# EAGLE design leka (EAGLE 7.2.0)
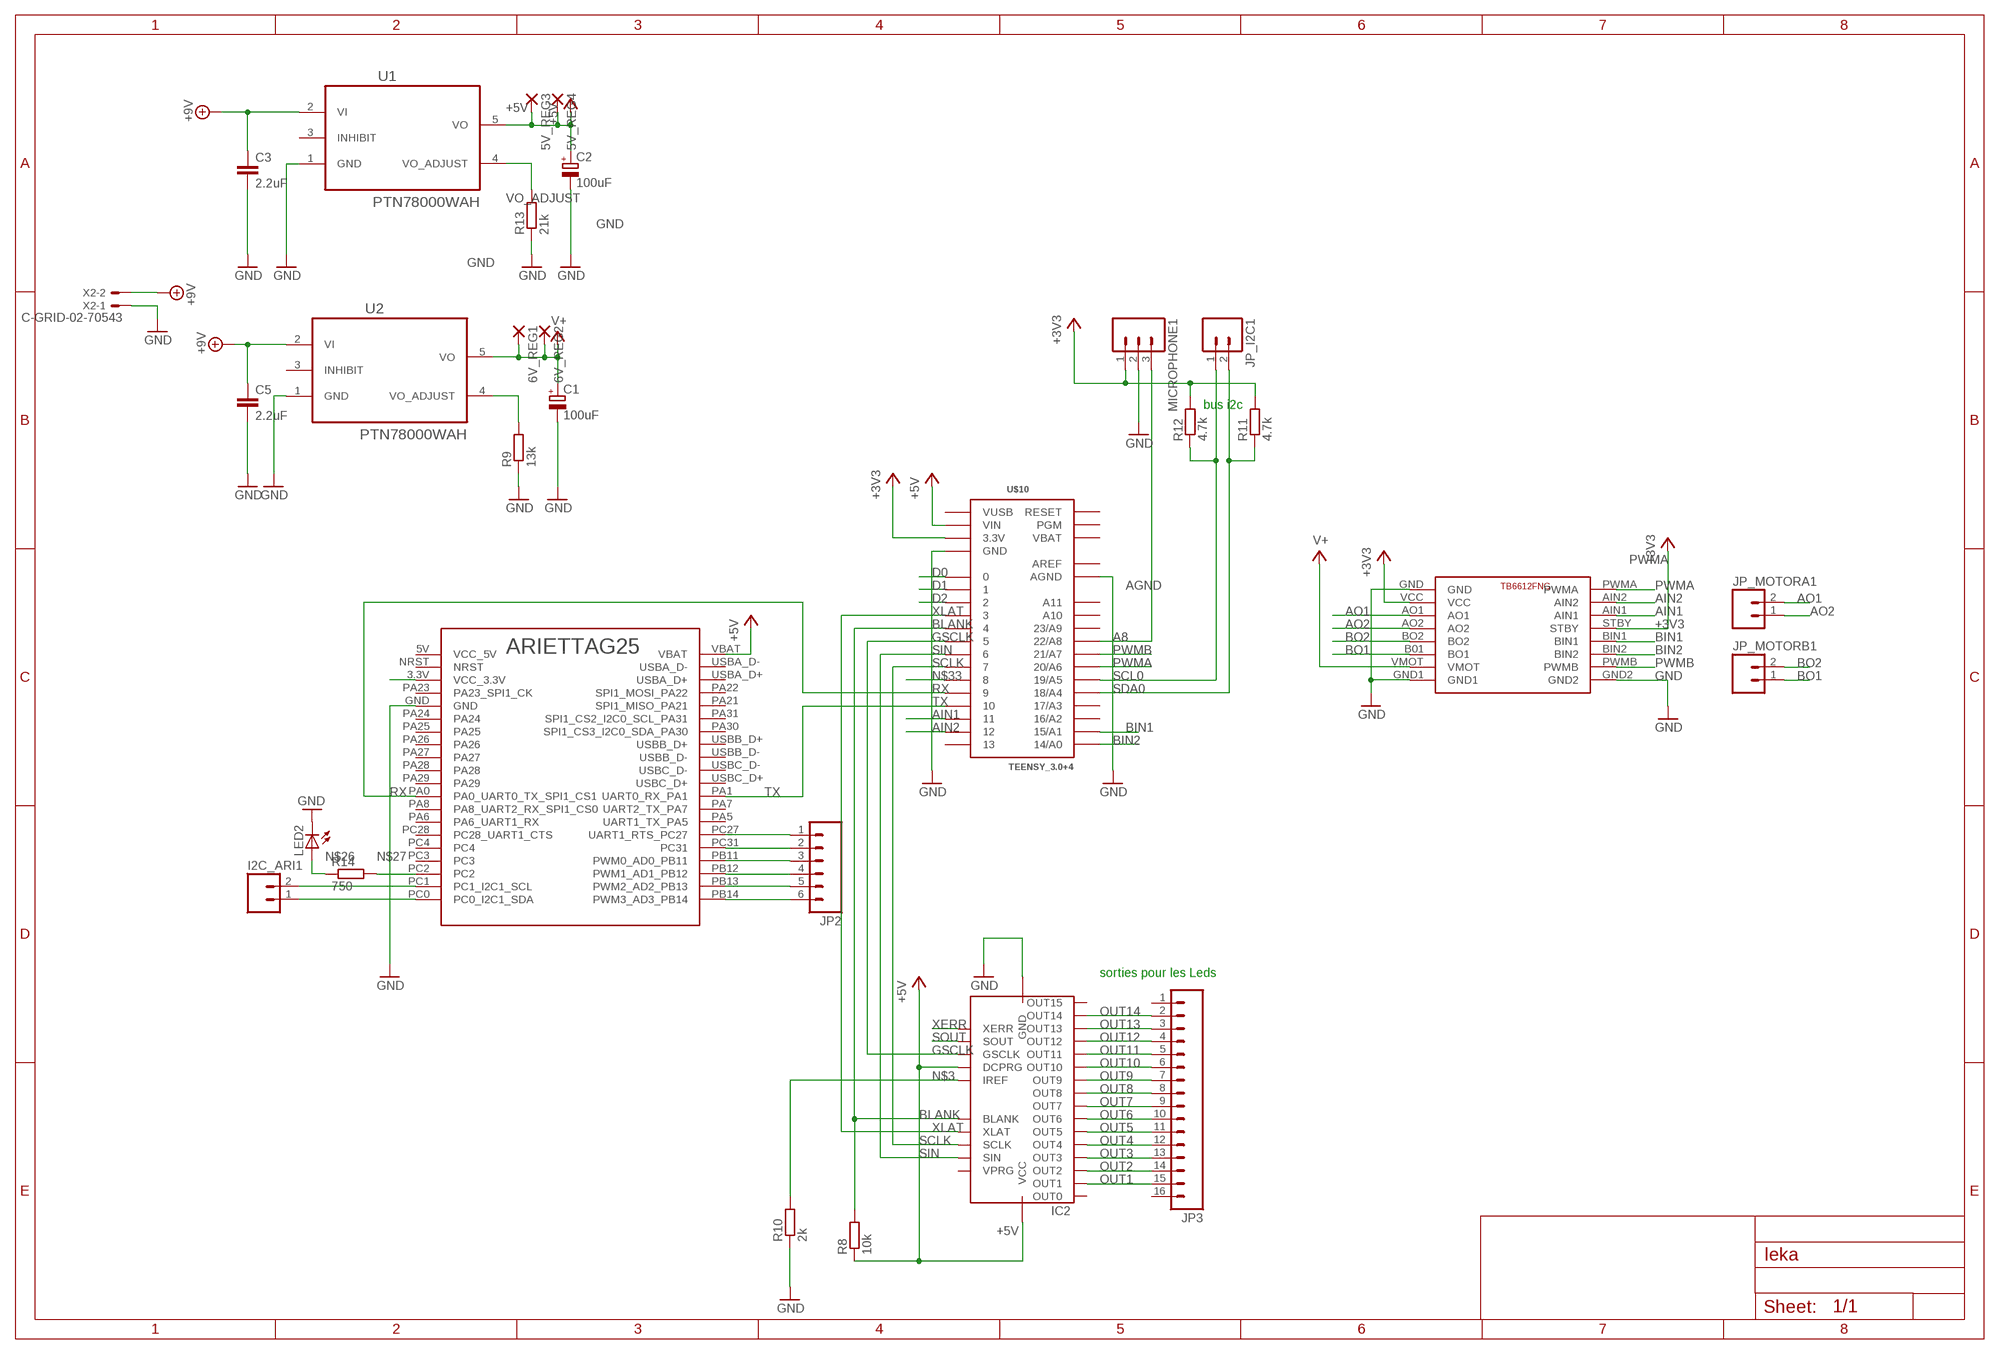
[diagram p0: schematic, sheet 1]

## Parts
5V_REG3  2,54/0,9  [2,54/0,9]
5V_REG4  2,54/0,9  [2,54/0,9]
6V_REG1  2,54/0,9  [2,54/0,9]
6V_REG2  2,54/0,9  [2,54/0,9]
C1  100uF  CPOL-EUE2-5  [E2-5]
C2  100uF  CPOL-EUE2-5  [E2-5]
C3  2.2uF  C-EUC0805  [C0805]
C5  2.2uF  C-EUC0805  [C0805]
I2C_ARI1  M02LOCK_LONGPADS  [1X02_LOCK_LONGPADS]
IC2  IC-PACKAGE_DIL28-3  [IC-PACKAGE_DIL28-3]
JP2  M06SILK_FEMALE_PTH  [1X06]
JP3  M16LONGPADS  [1X16_LONGPADS]
JP_I2C1  M02LOCK_LONGPADS  [1X02_LOCK_LONGPADS]
JP_MOTORA1  M02JST-PTH-2  [JST-2-PTH]
JP_MOTORB1  M02JST-PTH-2  [JST-2-PTH]
LED2  LEDSML0805  [SML0805]
MICROPHONE1  M03PTH  [1X03]
R8  10k  R-EU_M0805  [M0805]
R9  13k  R-EU_M0805  [M0805]
R10  2k  R-EU_M0805  [M0805]
R11  4.7k  R-EU_M0805  [M0805]
R12  4.7k  R-EU_M0805  [M0805]
R13  21k  R-EU_M0805  [M0805]
R14  750  R-EU_M0805  [M0805]
U1  PTN78000WAH  [TI_PTN78000WAH]
U2  PTN78000WAH  [TI_PTN78000WAH]
U$2  ARIETTAG25/256  [ARIETTAG25]
U$6  TB6612FNG  [MOTOR_DRIVER]
U$10  TEENSY_3.0+4  [TEENSY_3.0+4]
X2  C-GRID-02-70543  [70543-02]

## Nets
+3V3: MICROPHONE1.1 R11.2 R12.2 U$6.STBY U$6.VCC U$10.3.3V U$10.3.3V1(3.3V)
+5V: 5V_REG3.1(P) 5V_REG4.1(P) C2.+ IC2.19(DCPRG) IC2.21(VCC) R8.1 U1.5(VO) U$2.VBAT U$10.VIN
+9V: C3.1 C5.1 U1.2(VI) U2.2(VI) X2.2
A8: MICROPHONE1.3 U$10.22/A8
AGND: U$10.AGND ; supply symbol labelled GND
AIN1: U$6.AIN1 U$10.11
AIN2: U$6.AIN2 U$10.12
AO1: JP_MOTORA1.2 U$6.AO1
AO2: JP_MOTORA1.1 U$6.AO2
BIN1: U$6.BIN1 U$10.15/A1
BIN2: U$6.BIN2 U$10.14/A0
BLANK: IC2.23(BLANK) R8.2 U$10.4
BO1: JP_MOTORB1.1 U$6.B01(BO1)
BO2: JP_MOTORB1.2 U$6.BO2
D0: U$10.0
D1: U$10.1
D2: U$10.2
GND: C1.- C2.- C3.2 C5.2 IC2.22(GND) LED2.C MICROPHONE1.2 R9.1 R10.1 R13.1 U1.1(GND) U2.1(GND) U$2.GND U$6.GND U$6.GND1 U$6.GND2 U$10.GND U$10.GND1(GND) X2.1
GSCLK: IC2.18(GSCLK) U$10.5
N$3: IC2.20(IREF) R10.2
N$15: U$2.3.3V(VCC_3.3V)
N$16: I2C_ARI1.1 U$2.PC0(PC0_I2C1_SDA)
N$17: I2C_ARI1.2 U$2.PC1(PC1_I2C1_SCL)
N$19: R9.2 U2.4(VO_ADJUST)
N$20: JP2.6 U$2.PB14(PWM3_AD3_PB14)
N$21: JP2.5 U$2.PB13(PWM2_AD2_PB13)
N$22: JP2.4 U$2.PB12(PWM1_AD1_PB12)
N$23: JP2.2 U$2.PC31
N$24: JP2.1 U$2.PC27(UART1_RTS_PC27)
N$25: JP2.3 U$2.PB11(PWM0_AD0_PB11)
N$26: LED2.A R14.1
N$27: R14.2 U$2.PC2
N$33: U$10.8
OUT1: IC2.1(OUT1) JP3.15
OUT2: IC2.2(OUT2) JP3.14
OUT3: IC2.3(OUT3) JP3.13
OUT4: IC2.4(OUT4) JP3.12
OUT5: IC2.5(OUT5) JP3.11
OUT6: IC2.6(OUT6) JP3.10
OUT7: IC2.7(OUT7) JP3.9
OUT8: IC2.8(OUT8) JP3.8
OUT9: IC2.9(OUT9) JP3.7
OUT10: IC2.10(OUT10) JP3.6
OUT11: IC2.11(OUT11) JP3.5
OUT12: IC2.12(OUT12) JP3.4
OUT13: IC2.13(OUT13) JP3.3
OUT14: IC2.14(OUT14) JP3.2
PWMA: U$6.PWMA U$10.20/A6
PWMB: U$6.PWMB U$10.21/A7
RX: U$2.PA0(PA0_UART0_TX_SPI1_CS1) U$10.9
SCL0: JP_I2C1.1 R12.1 U$10.19/A5
SCLK: IC2.25(SCLK) U$10.7
SDA0: JP_I2C1.2 R11.1 U$10.18/A4
SIN: IC2.26(SIN) U$10.6
SOUT: IC2.17(SOUT)
TX: U$2.PA1(UART0_RX_PA1) U$10.10
V+: 6V_REG1.1(P) 6V_REG2.1(P) C1.+ U2.5(VO) U$6.VMOT
VO_ADJUST: R13.2 U1.4(VO_ADJUST)
XERR: IC2.16(XERR)
XLAT: IC2.24(XLAT) U$10.3
Unconnected: IC2.15(OUT15) IC2.27(VPRG) IC2.28(OUT0) JP3.1 JP3.16 U1.3(INHIBIT) U2.3(INHIBIT) U$2.NRST U$2.PA5(UART1_TX_PA5) U$2.PA6(PA6_UART1_RX) U$2.PA7(UART2_TX_PA7) U$2.PA8(PA8_UART2_RX_SPI1_CS0) U$2.PA21(SPI1_MISO_PA21) U$2.PA22(SPI1_MOSI_PA22) U$2.PA23(PA23_SPI1_CK) U$2.PA24 U$2.PA25 U$2.PA26 U$2.PA27 U$2.PA28 U$2.PA29 U$2.PA30(SPI1_CS3_I2C0_SDA_PA30) U$2.PA31(SPI1_CS2_I2C0_SCL_PA31) U$2.PC3 U$2.PC4 U$2.PC28(PC28_UART1_CTS) U$2.USBA_D+ U$2.USBA_D- U$2.USBB_D+ U$2.USBB_D- U$2.USBC_D+ U$2.USBC_D- U$10.13 U$10.16/A2 U$10.17/A3 U$10.23/A9 U$10.A10 U$10.A11 U$10.PGM U$10.RESET

## Notes on the sheet
- bus i2c
- sorties pour les Leds

## Power pins joined to a net without a drawn wire
AREF: U$10.AREF
VBAT: U$10.VBAT
VCC_5V: U$2.5V(VCC_5V)
VUSB: U$10.VUSB

## Library data of the parts
5V_REG3 5V_REG4 6V_REG1 6V_REG2 = wirepad:2,54/0,9: THROUGH-HOLE PAD
C1 C2 = resistor:CPOL-EU: POLARIZED CAPACITOR, European symbol
C3 C5 = resistor:C-EU: CAPACITOR, European symbol
I2C_ARI1 JP_I2C1 = SparkFun-Connectors:M02: Standard 2-pin 0.1" header. Use with - straight break away headers ( PRT-00116) - right angle break away headers (PRT-00553) - swiss pins (PRT-00743) - machine pins (PRT-00117) - female headers (PRT-00115) Molex polarized connector foot print use with: PRT-08233 with associated crimp pins and housings. 2.54_SCREWTERM for use with PRT-10571. 3.5mm Screw Terminal footprints for PRT-08084 5mm Screw Terminal footprints for use with PRT-08432
IC2 = TLC5940:IC-PACKAGE_DIL28: Dual In Line
JP2 = SparkFun-Connectors:M06: Header 6 Standard 6-pin 0.1" header. Use with straight break away headers (SKU : PRT-00116), right angle break away headers (PRT-00553), swiss pins (PRT-00743), machine pins (PRT-00117), and female headers (PRT-00115). Molex polarized connector foot print use with SKU : PRT-08094 with associated crimp pins and housings. NOTES ON THE VARIANTS LOCK and LOCK_LONGPADS... This footprint was designed to help hold the alignment of a through-hole component (i.e. 6-pin header) while soldering it into place. You may notice that each hole has been shifted either up or down by 0.005 of an inch from it's more standard position (which is a perfectly straight line). This slight alteration caused the pins (the squares in the middle) to touch the edges of the holes. Because they are alternating, it causes a "brace" to hold the component in place. 0.005 has proven to be the perfect amount of "off-center" position when using our standard breakaway headers. Although looks a little odd when you look at the bare footprint, once you have a header in there, the alteration is very hard to notice. Also,if you push a header all the way into place, it is covered up entirely on the bottom side. This idea of altering the position of holes to aid alignment will be further integrated into the Sparkfun Library for other footprints. It can help hold any component with 3 or more connection pins.; PROD_ID: CONN-08437
JP3 = SparkFun-Connectors:M16: 1x16 .1" header
JP_MOTORA1 JP_MOTORB1 = SparkFun-Connectors:M02: Standard 2-pin 0.1" header. Use with - straight break away headers ( PRT-00116) - right angle break away headers (PRT-00553) - swiss pins (PRT-00743) - machine pins (PRT-00117) - female headers (PRT-00115) Molex polarized connector foot print use with: PRT-08233 with associated crimp pins and housings. 2.54_SCREWTERM for use with PRT-10571. 3.5mm Screw Terminal footprints for PRT-08084 5mm Screw Terminal footprints for use with PRT-08432; PROD_ID: CONN-09863; SKU: PRT-09914
LED2 = led:LED: LED OSRAM: - CHIPLED LG R971, LG N971, LY N971, LG Q971, LY Q971, LO R971, LY R971 LH N974, LH R974 LS Q976, LO Q976, LY Q976 LO Q996 - Hyper CHIPLED LW Q18S LB Q993, LB Q99A, LB R99A - SideLED LS A670, LO A670, LY A670, LG A670, LP A670 LB A673, LV A673, LT A673, LW A673 LH A674 LY A675 LS A676, LA A676, LO A676, LY A676, LW A676 LS A679, LY A679, LG A679 - Hyper Micro SIDELED® LS Y876, LA Y876, LO Y876, LY Y876 LT Y87S - SmartLED LW L88C, LW L88S LB L89C, LB L89S, LG L890 LS L89K, LO L89K, LY L89K LS L896, LA L896, LO L896, LY L896 - TOPLED LS T670, LO T670, LY T670, LG T670, LP T670 LSG T670, LSP T670, LSY T670, LOP T670, LYG T670 LG T671, LOG T671, LSG T671 LB T673, LV T673, LT T673, LW T673 LH T674 LS T676, LA T676, LO T676, LY T676, LB T676, LH T676, LSB T676, LW T676 LB T67C, LV T67C, LT T67C, LS T67K, LO T67K, LY T67K, LW E67C LS E67B, LA E67B, LO E67B, LY E67B, LB E67C, LV E67C, LT E67C LW T67C LS T679, LY T679, LG T679 LS T770, LO T770, LY T770, LG T770, LP T770 LB T773, LV T773, LT T773, LW T773 LH T774 LS E675, LA E675, LY E675, LS T675 LS T776, LA T776, LO T776, LY T776, LB T776 LHGB T686 LT T68C, LB T68C - Hyper Mini TOPLED® LB M676 - Mini TOPLED Santana® LG M470 LS M47K, LO M47K, LY M47K Source: http://www.osram.convergy.de LUXEON: - LUMILED® LXK2-PW12-R00, LXK2-PW12-S00, LXK2-PW14-U00, LXK2-PW14-V00 LXK2-PM12-R00, LXK2-PM12-S00, LXK2-PM14-U00 LXK2-PE12-Q00, LXK2-PE12-R00, LXK2-PE12-S00, LXK2-PE14-T00, LXK2-PE14-U00 LXK2-PB12-K00, LXK2-PB12-L00, LXK2-PB12-M00, LXK2-PB14-N00, LXK2-PB14-P00, LXK2-PB14-Q00 LXK2-PR12-L00, LXK2-PR12-M00, LXK2-PR14-Q00, LXK2-PR14-R00 LXK2-PD12-Q00, LXK2-PD12-R00, LXK2-PD12-S00 LXK2-PH12-R00, LXK2-PH12-S00 LXK2-PL12-P00, LXK2-PL12-Q00, LXK2-PL12-R00 Source: www.luxeon.com KINGBRIGHT: KA-3528ASYC Source: www.kingbright.com
MICROPHONE1 = SparkFun-Connectors:M03: Header 3 Standard 3-pin 0.1" header. Use with straight break away headers (SKU : PRT-00116), right angle break away headers (PRT-00553), swiss pins (PRT-00743), machine pins (PRT-00117), and female headers (PRT-00115). Molex polarized connector foot print use with SKU : PRT-08232 with associated crimp pins and housings.
R8-R14 = resistor:R-EU_: RESISTOR, European symbol
U1 U2 = TI-Eagle_library:PTN78000WAH: SWITCHING REG, 2.5 TO 12.6V 1.5A,Through-Hole Module; MPN: PTN78000WAH; OC_FARNELL: 1564908; OC_NEWARK: 65J6317; PACKAGE: Through-Hole Module; SUPPLIER: TEXAS INSTRUMENTS
U$2 = robot_insa_V1:ARIETTAG25/256
U$6 = motor_driver:TB6612FNG
U$10 = Teensy3.0:TEENSY_3.0+4: Teensy 3.0 board, showing all pins that are easily acessible. See 'AllAnalogPins" and 'AllPins' packages for additional pin holes, as needed. The 'Basic' package has fewer pins.
X2 = con-molex:C-GRID-02: CONNECTOR wire to board 2.54 mm (0.100") pitch header; OC_FARNELL: unknown; OC_NEWARK: unknown

## Board
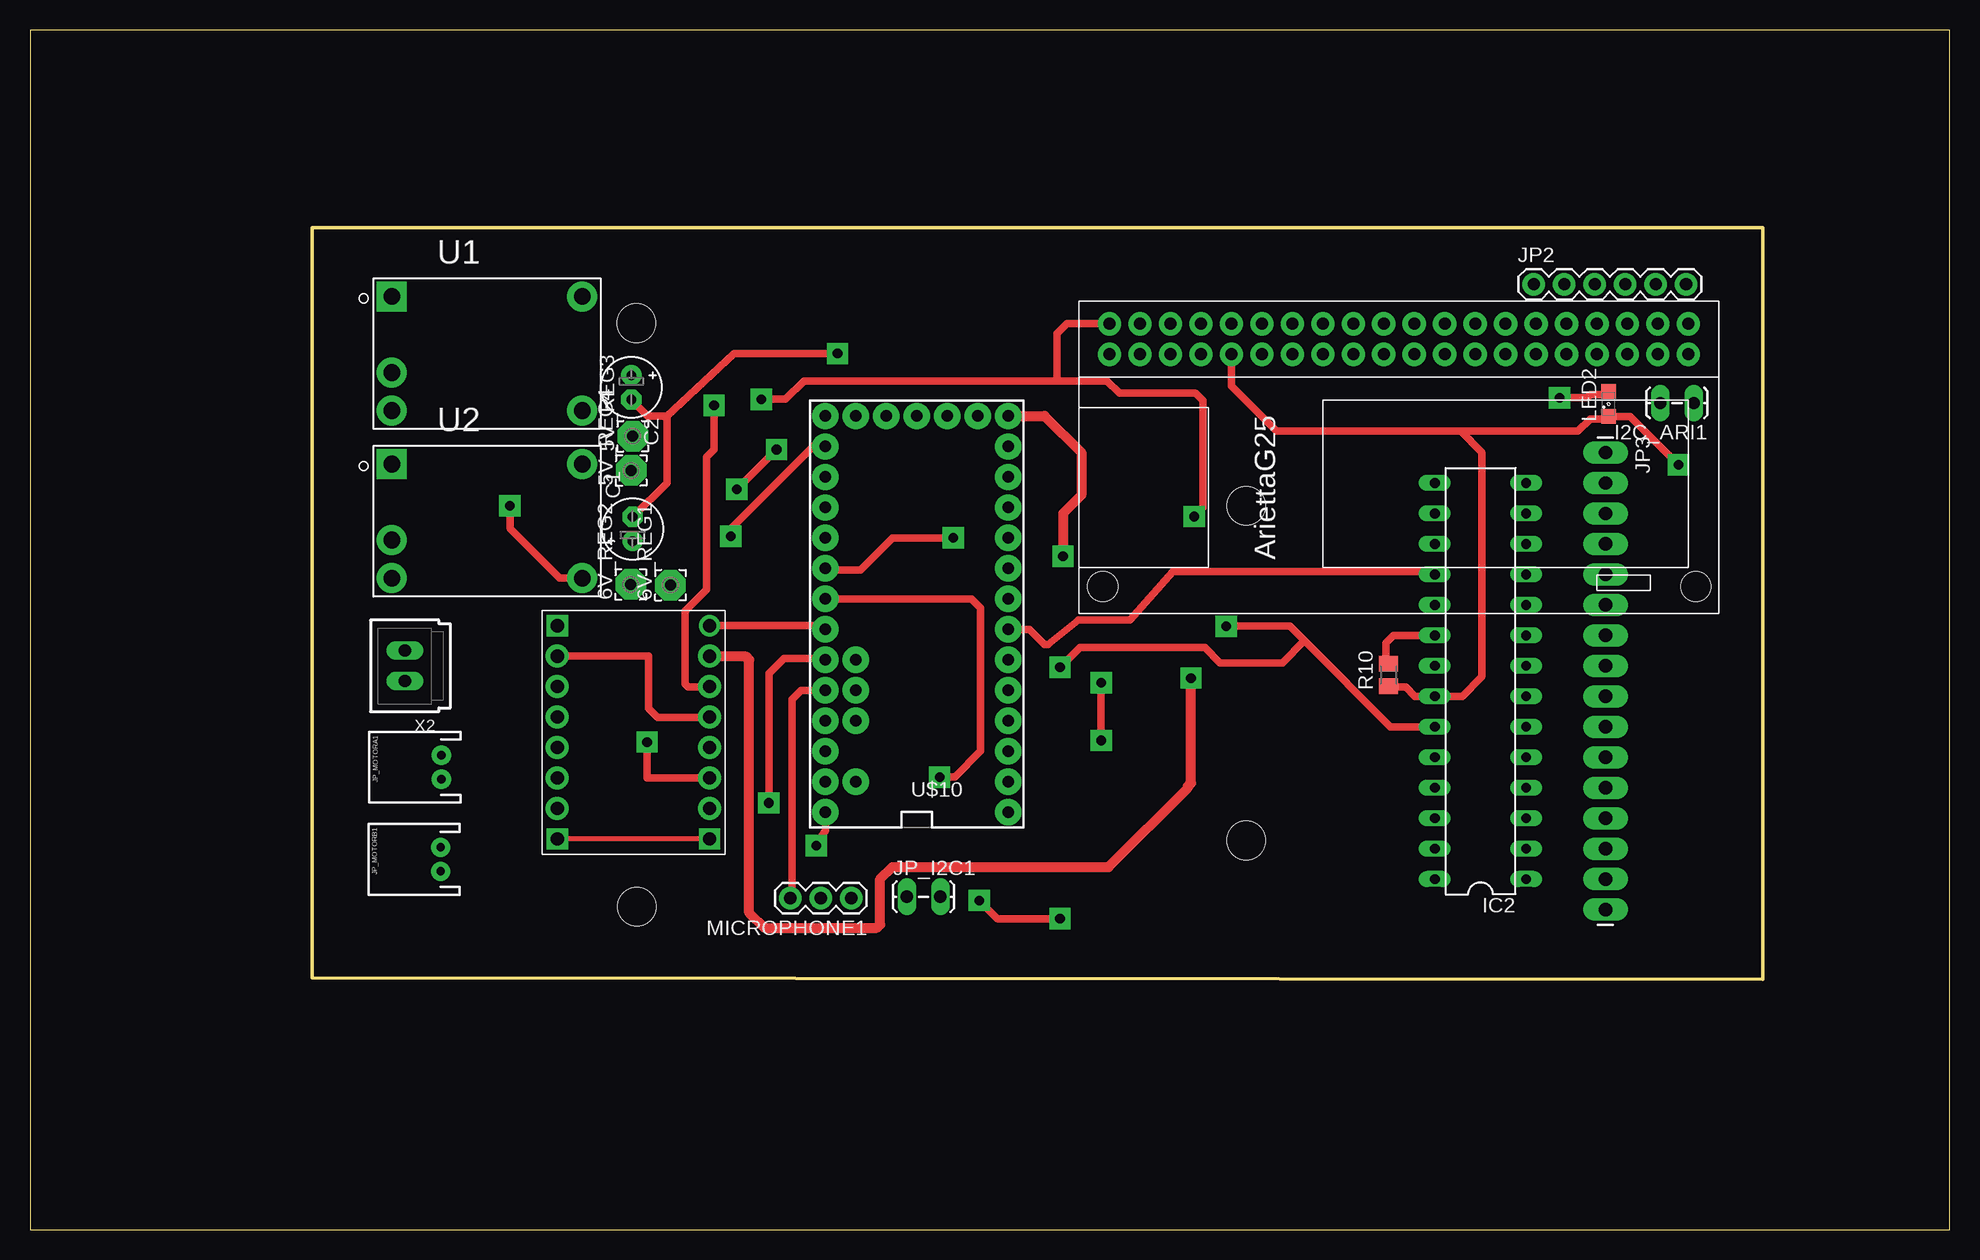
[diagram p1: board, top side]
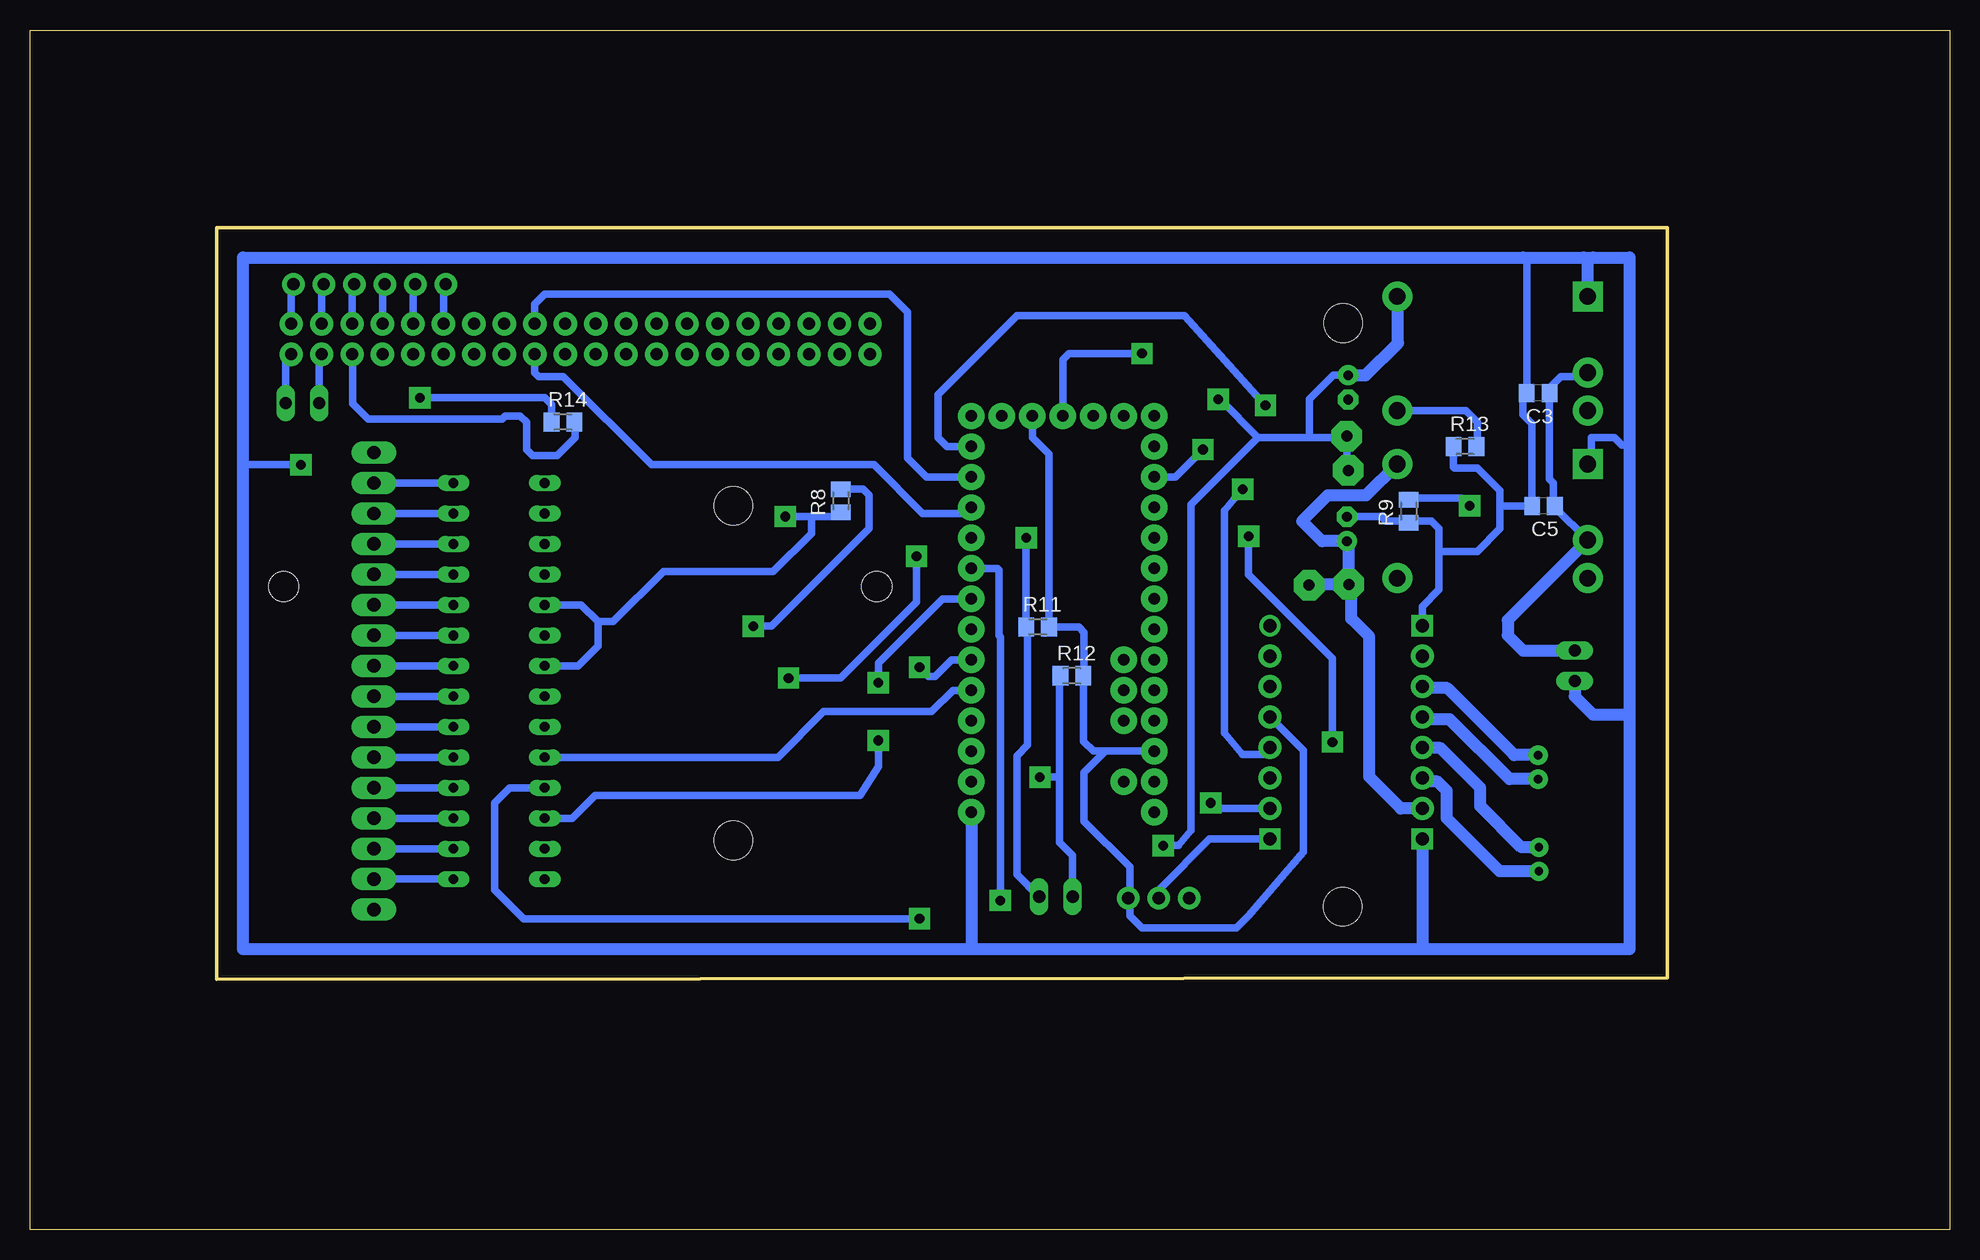
[diagram p2: board, bottom side, seen from below]

Size 160 x 100 mm. Coordinates in mm from the lower left corner, seen from the top.
Outline: 0,0 160,0 160,100 0,100 0,0
Outline: 23.52,83.52 23.52,21 144.42,20.87 144.42,83.52 23.52,83.52
Copper layers (1*16): Top 0.035mm / dielectric 1.5mm / Bottom 0.035mm
Design rules "default *": minimum track width 10mil, minimum drill 24mil, track to track 8mil, track to pad 8mil, pad to pad 8mil, via to via 8mil, smd to smd 8mil, copper to edge 40mil, drill to drill 12mil, minimum pad ring 10mil, minimum via ring 8mil, stop-mask expansion 4mil, vias tented up to drill 0mil, thermal gap 10mil
Holes 3.2 mm at 50.57,26.92 50.55,75.56 101.37,60.33 101.37,32.44

### Footprints (pad centres in the part's own frame; a part is rotated, then mirrored left to right if it is on the bottom)
2,54/0,9 = drill 0.914 pad 2.54 octagon: 1 0,0
E2-5 = drill 0.813 pad 1.676: + -1.016,0 | drill 0.813 pad 1.676 octagon: - 1.016,0
C0805 = smd 1.3 x 1.5: 1 -0.95,0; 2 0.95,0
1X02_LOCK_LONGPADS = drill 1.016 long: 1 -0.127,0; 2 2.667,0
IC-PACKAGE_DIL28-3 = drill 0.813 long: 1 -16.51,-3.81; 2 -13.97,-3.81; 3 -11.43,-3.81; 4 -8.89,-3.81; 5 -6.35,-3.81; 6 -3.81,-3.81; 7 -1.27,-3.81; 8 1.27,-3.81; 9 3.81,-3.81; 10 6.35,-3.81; 11 8.89,-3.81; 12 11.43,-3.81; 13 13.97,-3.81; 14 16.51,-3.81; 15 16.51,3.81; 16 13.97,3.81; 17 11.43,3.81; 18 8.89,3.81; 19 6.35,3.81; 20 3.81,3.81; 21 1.27,3.81; 22 -1.27,3.81; 23 -3.81,3.81; 24 -6.35,3.81; 25 -8.89,3.81; 26 -11.43,3.81; 27 -13.97,3.81; 28 -16.51,3.81
1X06 = drill 1.016 pad 1.88: 1 0,0; 2 2.54,0; 3 5.08,0; 4 7.62,0; 5 10.16,0; 6 12.7,0
1X16_LONGPADS = drill 1.118 pad 1.88 long: 1 0,0; 2 2.54,0; 3 5.08,0; 4 7.62,0; 5 10.16,0; 6 12.7,0; 7 15.24,0; 8 17.78,0; 9 20.32,0; 10 22.86,0; 11 25.4,0; 12 27.94,0; 13 30.48,0; 14 33.02,0; 15 35.56,0; 16 38.1,0
JST-2-PTH = drill 0.7 pad 1.6: 1 -1,0; 2 1,0
SML0805 = smd 1.2 x 1.2: A 1.05,0; C -1.05,0
1X03 = drill 1.016 pad 1.88: 1 0,0; 2 2.54,0; 3 5.08,0
M0805 = smd 1.3 x 1.6: 1 -0.95,0; 2 0.95,0
TI_PTN78000WAH = drill 1.4 pad 2.5 square: 1 -7.94,4.763 | drill 1.4 pad 2.5: 2 -7.94,-1.587; 3 -7.94,-4.763; 4 7.94,-4.763; 5 7.94,4.763
ARIETTAG25 = drill 1 pad 1.93: 3.3V 10.16,20.32; 5V 10.16,25.4; GND 10.16,15.24; NRST 10.16,22.86; PA0 10.16,-2.54; PA1 12.7,-2.54; PA5 12.7,-7.62; PA6 10.16,-7.62; PA7 12.7,-5.08; PA8 10.16,-5.08; PA21 12.7,15.24; PA22 12.7,17.78; PA23 10.16,17.78; PA24 10.16,12.7; PA25 10.16,10.16; PA26 10.16,7.62; PA27 10.16,5.08; PA28 10.16,2.54; PA29 10.16,0; PA30 12.7,10.16; PA31 12.7,12.7; PB11 12.7,-15.24; PB12 12.7,-17.78; PB13 12.7,-20.32; PB14 12.7,-22.86; PC0 10.16,-22.86; PC1 10.16,-20.32; PC2 10.16,-17.78; PC3 10.16,-15.24; PC4 10.16,-12.7; PC27 12.7,-10.16; PC28 10.16,-10.16; PC31 12.7,-12.7; USBA_D+ 12.7,20.32; USBA_D- 12.7,22.86; USBB_D+ 12.7,7.62; USBB_D- 12.7,5.08; USBC_D+ 12.7,0; USBC_D- 12.7,2.54; VBAT 12.7,25.4 | hole 2.5: -9.195,25.959; -9.195,-23.47
MOTOR_DRIVER = drill 1.1 pad 1.93: AIN1 6.35,3.81; AIN2 6.35,6.35; AO1 -6.35,3.81; AO2 -6.35,1.27; B01 -6.35,-3.81; BIN1 6.35,-1.27; BIN2 6.35,-3.81; BO2 -6.35,-1.27; PWMB 6.35,-6.35; STBY 6.35,1.27; VCC -6.35,6.35; VMOT -6.35,-6.35 | drill 1.1 pad 1.778 square: GND -6.35,8.89; GND1 -6.35,-8.89; GND2 6.35,-8.89 | drill 1.1 pad 1.778: PWMA 6.35,8.89
TEENSY_3.0+4 = drill 0.965 pad 2.184: 0 -7.62,13.97; 1 -7.62,11.43; 2 -7.62,8.89; 3 -7.62,6.35; 3.3V 7.62,11.43; 3.3V1 -2.54,-16.51; 4 -7.62,3.81; 5 -7.62,1.27; 6 -7.62,-1.27; 7 -7.62,-3.81; 8 -7.62,-6.35; 9 -7.62,-8.89; 10 -7.62,-11.43; 11 -7.62,-13.97; 12 -7.62,-16.51; 13 7.62,-16.51; 14/A0 7.62,-13.97; 15/A1 7.62,-11.43; 16/A2 7.62,-8.89; 17/A3 7.62,-6.35; 18/A4 7.62,-3.81; 19/A5 7.62,-1.27; 20/A6 7.62,1.27; 21/A7 7.62,3.81; 22/A8 7.62,6.35; 23/A9 7.62,8.89; A10 5.08,6.35; A11 5.08,3.81; AGND 7.62,13.97; AREF 5.08,8.89; GND -7.62,16.51; GND1 0,-16.51; PGM 2.54,-16.51; RESET 5.08,-16.51; VBAT -5.08,-16.51; VIN 7.62,16.51; VUSB 5.08,13.97
70543-02 = drill 1.016 long: 1 -1.27,0; 2 1.27,0

### Placement (x,y rotation side)
5V_REG3  50.24,66.14 90 top
5V_REG4  50.12,63.29 90 top
6V_REG1  53.38,53.72 90 top
6V_REG2  50.07,53.78 90 top
C1  50.23,58.4 90 top
C2  50.12,70.2 270 top
C3  34.29,69.72 180 bottom
C5  33.85,60.33 180 bottom
I2C_ARI1  138.56,68.9 180 top
IC2  120.9,45.72 90 top
JP2  125.35,78.8 0 top
JP3  131.32,64.77 270 top
JP_I2C1  73.22,27.75 0 top
JP_MOTORA1  34.29,38.54 90 top
JP_MOTORB1  34.23,30.86 90 top
LED2  131.57,68.83 90 top
MICROPHONE1  68.45,27.62 180 top
R8  92.42,60.75 90 bottom
R9  45.09,59.88 90 bottom
R10  113.22,46.23 90 top
R11  76.01,50.23 0 bottom
R12  73.15,46.16 0 bottom
R13  40.39,65.28 0 bottom
R14  115.57,67.31 0 bottom
U1  38.1,73.03 0 top
U2  38.1,59.05 0 top
U$2  115.38,62.8 90 top
U$6  50.3,41.45 0 top
U$10  73.91,51.31 180 top
X2  31.24,46.99 90 top

### Tracks (layer width: path | path; a pad name or v marks a point on that pad's centre or on a via)
+3V3
  Top 0.61: U$6.VCC 51.57,47.8 51.57,43.43 52.32,42.67 56.6,42.67
  Top 0.813: 56.6,42.67 U$6.STBY
  Bottom 0.61: U$10.3.3V1 76.45,66.04 75.06,64.64 R11.2 72.58,50.23 72.14,49.78 72.14,46.23 R12.2 72.2,40.71 71.37,39.88 U$10.3.3V 70.36,39.88 72.14,38.1 72.14,34.04 68.33,30.23 68.33,28 | U$6.STBY 53.87,39.93 53.87,31.47 58.42,26.16 59.44,25.15 67.31,25.15 68.33,26.16 68.33,27.5 MICROPHONE1.1 68.33,28 | 68.33,28 68.33,27.75
+5V  (via drill 0.8 pad 1.78)
  Top 0.61: U$10.VIN 66.29,33.27 v65.53,32 | v97.03,59.44 97.79,60.2 97.79,69.09 97.16,69.72 90.81,69.72 89.79,70.74 85.6,70.74 | v60.96,69.22 62.99,69.22 64.52,70.74 85.6,70.74 | U$2.VBAT 86.42,75.5 85.6,74.68 85.6,70.74
  Bottom 0.61: v65.53,32 64.26,32 63.25,33.27 63.25,60.45 57.66,66.04 | 57.66,66.04 53.34,66.04 | 53.34,66.04 50.4,66.04 5V_REG3.1 50.24,63.41 5V_REG4.1 | IC2.19 114.05,52.07 112.65,50.67 | 112.65,50.67 112.65,48.64 114.3,46.99 IC2.21 | v97.03,59.44 94.74,59.44 | v60.96,69.22 60.83,69.22 57.66,66.04 | C2.+ 51.34,71.22 53.34,69.22 53.34,66.04 | 45.97,77.72 U1.5 | 112.65,50.67 111.38,50.67 107.19,54.86 98.04,54.86 94.87,58.04 94.87,59.31 94.74,59.44 | 94.74,59.44 92.78,59.44 R8.1
  Bottom 1.016: C2.+ 48.67,71.22 45.97,73.91 45.97,77.72
+9V
  Bottom 0.61: U1.2 30.48,71.12 32.38,71.12 33.34,70.17 C3.1 33.34,62.55 33.02,62.23 33.02,60.45 C5.1 32.9,60.2 U2.2
  Bottom 1.016: U2.2 36.83,50.8 36.83,49.53 35.56,48.26 X2.2
A8
  Top 0.61: U$10.22/A8 64.26,44.96 63.5,44.2 63.5,27.75 MICROPHONE1.3
AIN1  (via drill 0.8 pad 1.78)
  Top 0.61: U$6.AIN1 56.6,45.21 54.86,45.21 54.61,45.47 54.61,51.56 56.39,53.34 56.39,64.39 57.02,65.02 v57.02,68.71
  Bottom 0.61: U$10.11 83.57,65.28 84.33,66.04 84.33,69.6 77.72,76.2 63.75,76.2 v57.02,68.71
AIN2  (via drill 0.8 pad 1.78)
  Top 0.61: 70.61,25.15 70.87,25.4
  Top 0.813: U$10.12 84.58,67.82 87.63,64.77 87.63,61.21 86.11,59.69 v86.11,56.13 | U$6.AIN2 56.7,47.75 59.69,47.75 59.94,47.5 59.94,26.42 61.21,25.15 70.61,25.15 | 70.87,25.4 70.87,29.21 71.88,30.23 89.92,30.23 96.52,36.83 96.52,36.96 96.77,37.21 v96.77,45.97
  Bottom 0.61: v86.11,56.13 86.11,52.32 92.46,45.97 v96.77,45.97
AO1
  Bottom 1.016: JP_MOTORA1.2 36.28,39.54 41.87,45.13 43.82,45.13 U$6.AO1
AO2
  Bottom 1.016: JP_MOTORA1.1 36.68,37.54 41.67,42.53 43.76,42.53 U$6.AO2
BIN1  (via drill 0.8 pad 1.78)
  Top 0.61: v58.93,61.72 v62.23,65.02
  Bottom 0.61: v58.93,61.72 60.45,59.94 60.45,41.4 58.93,39.62 57.21,39.62 U$6.BIN1 | v62.23,65.02 64.52,62.74 U$10.15/A1
BIN2  (via drill 0.8 pad 1.78)
  Top 0.61: U$6.BIN2 51.44,37.64 v51.44,40.64 | v58.42,57.78 58.42,58.42 65.41,65.41 66.17,65.41 U$10.14/A0
  Bottom 0.61: v51.44,40.64 51.44,47.62 58.42,54.61 v58.42,57.78
BLANK  (via drill 0.8 pad 1.78)
  Top 0.61: IC2.23 113.41,41.91 106.24,49.09 | 106.24,49.09 105.03,50.29 v99.69,50.29 | v85.85,46.86 87.5,48.51 97.92,48.51 99.19,47.24 104.39,47.24 106.24,49.09
  Bottom 0.61: v99.69,50.29 98.17,50.29 90.04,58.42 90.04,61.21 90.55,61.72 92.4,61.72 R8.2 | U$10.4 83.19,47.5 84.58,46.1 85.09,46.1 v85.85,46.86
BO1
  Bottom 1.016: JP_MOTORB1.1 37.48,29.86 41.91,34.29 41.91,36.58 42.67,37.34 43.65,37.34 U$6.B01
BO2
  Bottom 1.016: JP_MOTORB1.2 35.67,31.86 39.12,35.31 39.12,36.83 42.42,40.13 43.9,40.13 U$6.BO2
GND  (via drill 0.8 pad 1.78)
  Top 0.406: U$6.GND2 U$6.GND1
  Top 0.61: v67.31,73.03 58.67,73.03 53.09,67.82 52.83,67.82 | 52.83,67.82 51.49,67.82 C2.- | U$2.GND 100.14,70.29 103.89,66.55 119.25,66.55 | 119.25,66.55 129.03,66.55 130.05,67.56 131.35,67.56 LED2.C 133.38,67.78 v137.41,63.75 | C1.- 50.27,59.42 53.09,62.23 53.09,67.56 52.83,67.82 | R10.1 113.29,45.21 114.68,45.21 115.44,44.45 IC2.22 119.38,44.45 121.03,46.1 121.03,64.77 119.25,66.55
  Bottom 0.61: U$10.GND1 73.91,72.52 73.41,73.03 v67.31,73.03 | 26.67,65.02 27.05,65.41 27.3,65.41 27.94,66.04 29.84,66.04 29.84,64.13 U2.1 | 81.53,23.62 81.28,23.37 | 43.95,23.61 44.2,23.37 | U$6.GND2 61.67,32.56 65.79,28.45 65.79,27.75 MICROPHONE1.2 | v137.41,63.75 142.24,63.75 | C1.- 47.35,59.42 46.99,59.05 45.21,59.05 R9.1 44.96,59.05 43.18,59.05 42.55,58.42 42.55,56.52 | U$6.GND 43.95,51.94 42.55,53.34 42.55,56.52 | 37.47,60.33 C5.2 34.8,67.18 35.56,67.94 35.56,69.4 C3.2 35.24,80.71 35.56,81.03 | R13.1 41.34,63.56 41.27,63.5 39.37,63.5 37.47,61.59 37.47,60.33 | 37.47,60.33 37.47,58.42 39.37,56.52 42.55,56.52
  Bottom 0.813: 35.31,69.66 C3.2 | 29.65,80.96 29.72,81.03
  Bottom 1.016: 30.48,81.03 35.56,81.03 142.24,81.03 142.24,63.75 142.24,23.37 81.28,23.37 44.2,23.37 26.67,23.37 26.67,42.93 | 30.48,81.03 29.72,81.03 26.67,81.03 26.67,65.02 26.67,42.93 | X2.1 31.24,44.45 29.72,42.93 26.67,42.93 | U$10.GND 81.53,23.62 | U$6.GND1 43.95,23.61 | U1.1 30.16,80.71 30.48,81.03
GSCLK
  Top 0.61: U$10.5 83.31,50.04 84.58,48.77 84.84,48.77 87.38,50.8 91.69,50.8 95.25,54.86 116.84,54.86 IC2.18
N$3
  Top 0.61: IC2.20 113.67,49.53 113.03,48.9 113.03,47.37 R10.2
N$16
  Bottom 0.61: U$2.PC0 138.68,72.96 I2C_ARI1.1
N$17
  Bottom 0.61: U$2.PC1 135.89,72.96 I2C_ARI1.2
N$19  (via drill 0.8 pad 1.78)
  Top 0.61: U2.4 44.13,54.29 40.01,58.42 v40.01,60.33
  Bottom 0.61: v40.01,60.33 40.64,60.96 44.96,60.96 R9.2
  Bottom 1.016: R9.2 45.17,60.83
N$20
  Bottom 0.61: JP2.6 138.24,78.8 U$2.PB14
N$21
  Bottom 0.61: JP2.5 135.7,78.8 U$2.PB13
N$22
  Bottom 0.61: JP2.4 133.16,78.8 U$2.PB12
N$23
  Bottom 0.61: JP2.2 128.08,78.8 U$2.PC31
N$24
  Bottom 0.61: JP2.1 125.54,78.8 U$2.PC27
N$25
  Bottom 0.61: JP2.3 130.62,78.8 U$2.PB11
N$26  (via drill 0.8 pad 1.78)
  Top 0.61: v127.51,69.34 129.79,69.34 130.05,69.6 131.28,69.6 LED2.A
  Bottom 0.61: R14.1 116.52,68.77 117.09,69.34 v127.51,69.34
N$27
  Bottom 0.61: U$2.PC2 133.16,72.45 133.1,72.39 133.1,68.83 131.83,67.56 120.65,67.56 120.4,67.82 119.13,67.82 118.62,67.31 118.62,65.02 118.11,64.52 116.08,64.52 114.55,66.04 114.55,67.38 R14.2
OUT1
  Bottom 0.61: IC2.1 JP3.15
OUT2
  Bottom 0.61: IC2.2 JP3.14
OUT3
  Bottom 0.61: IC2.3 JP3.13
OUT4
  Bottom 0.61: IC2.4 JP3.12
OUT5
  Bottom 0.61: IC2.5 JP3.11
OUT6
  Bottom 0.61: IC2.6 JP3.10
OUT7
  Bottom 0.61: IC2.7 JP3.9
OUT8
  Bottom 0.61: IC2.8 JP3.8
OUT9
  Bottom 0.61: IC2.9 JP3.7
OUT10
  Bottom 0.61: IC2.10 JP3.6
OUT11
  Bottom 0.61: IC2.11 JP3.5
OUT12
  Bottom 0.61: IC2.12 JP3.4
OUT13
  Bottom 0.61: IC2.13 JP3.3
OUT14
  Bottom 0.61: IC2.14 JP3.2
PWMA
  Top 0.61: U$6.PWMA 65.99,50.34 U$10.20/A6
PWMB  (via drill 0.8 pad 1.78)
  Top 0.61: v61.59,35.56 61.59,46.35 62.87,47.62 66.17,47.62 U$10.21/A7
  Bottom 0.61: U$6.PWMB 61.13,35.1 v61.59,35.56
RX
  Bottom 0.61: U$2.PA0 117.92,71.44 117.6,71.12 115.57,71.12 108.2,63.75 89.66,63.75 85.6,59.69 82.04,59.69 U$10.9
SCL0  (via drill 0.8 pad 1.78)
  Top 0.61: U$10.19/A5 78.49,52.58 79.25,51.82 79.25,39.88 77.09,37.72 v75.82,37.72
  Bottom 0.61: JP_I2C1.1 73.09,31.18 74.17,32.26 74.17,37.85 | 74.17,37.85 74.17,46.1 R12.1 | v75.82,37.72 74.3,37.72 74.17,37.85
SCLK  (via drill 0.8 pad 1.78)
  Top 0.61: v85.85,25.91 80.64,25.91 v79.12,27.43
  Bottom 0.61: IC2.25 120.02,36.83 121.28,35.56 121.28,28.32 118.87,25.91 v85.85,25.91 | v79.12,27.43 79.12,49.4 79.25,49.53 79.25,54.99 79.38,55.12 U$10.7
SDA0  (via drill 0.8 pad 1.78)
  Top 0.61: v76.96,57.66 71.88,57.66 69.22,54.99 66.42,54.99 U$10.18/A4
  Bottom 0.61: JP_I2C1.2 77.72,29.59 77.72,39.5 76.83,40.39 76.83,50.1 R11.1 v76.96,57.66
SIN  (via drill 0.8 pad 1.78)
  Top 0.61: v89.28,40.77 v89.28,45.59
  Bottom 0.61: U$10.6 83.95,52.58 89.28,47.24 v89.28,45.59 | IC2.26 114.81,34.29 112.9,36.2 90.81,36.2 89.28,38.61 v89.28,40.77
TX
  Bottom 0.61: U$2.PA1 117.92,77.15 117.09,77.98 88.37,77.98 86.87,76.48 86.87,64.33 85.28,62.74 U$10.10
V+
  Bottom 1.016: U$6.VMOT 45.74,35.1 48.37,37.73 48.37,49.43 49.87,50.93 49.87,53.58 6V_REG2.1 | 6V_REG2.1 53.31,53.78 6V_REG1.1 | 6V_REG2.1 50.07,57.23 C1.+ 52.3,57.38 53.98,59.05 51.82,61.21 48.64,61.21 U2.5
VO_ADJUST
  Bottom 0.61: U1.4 40.32,68.26 39.37,67.31 39.37,65.34 R13.2
XLAT
  Bottom 0.61: U$10.3 83.06,44.96 84.84,43.18 93.85,43.18 97.66,39.37 IC2.24